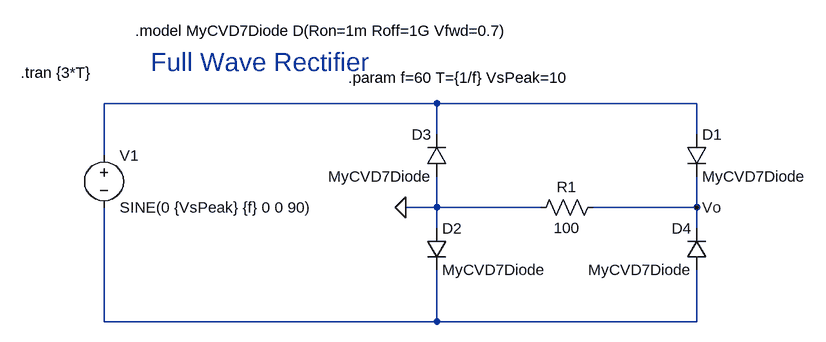
[diagram p0: schematic full_wave_rectifier.asc]
full_wave_rectifier.asc, the LTspice schematic file:
Version 4.1
SHEET 1 1084 680
WIRE 512 48 0 48
WIRE 912 48 512 48
WIRE 512 96 512 48
WIRE 912 96 912 48
WIRE 0 128 0 48
WIRE 512 208 512 160
WIRE 512 208 464 208
WIRE 672 208 512 208
WIRE 912 208 912 160
WIRE 912 208 752 208
WIRE 512 240 512 208
WIRE 912 240 912 208
WIRE 0 384 0 208
WIRE 512 384 512 304
WIRE 512 384 0 384
WIRE 912 384 912 304
WIRE 912 384 512 384
FLAG 464 208 0
FLAG 912 208 Vo
SYMBOL voltage 0 112 R0
WINDOW 123 0 0 Left 0
WINDOW 39 0 0 Left 0
SYMATTR InstName V1
SYMATTR Value SINE(0 {VsPeak} {f} 0 0 90)
SYMBOL diode 896 96 R0
SYMATTR InstName D1
SYMATTR Value MyCVD7Diode
SYMBOL diode 496 240 R0
SYMATTR InstName D2
SYMATTR Value MyCVD7Diode
SYMBOL diode 528 160 R180
WINDOW 0 24 64 Left 2
WINDOW 3 24 0 Left 2
SYMATTR InstName D3
SYMATTR Value MyCVD7Diode
SYMBOL diode 928 304 R180
WINDOW 0 24 64 Left 2
WINDOW 3 24 0 Left 2
SYMATTR InstName D4
SYMATTR Value MyCVD7Diode
SYMBOL res 768 192 R90
WINDOW 0 0 56 VBottom 2
WINDOW 3 32 56 VTop 2
SYMATTR InstName R1
SYMATTR Value 100
TEXT 72 -16 Left 4 ;Full Wave Rectifier
TEXT 48 -64 Left 2 !.model MyCVD7Diode D(Ron=1m Roff=1G Vfwd=0.7)
TEXT -128 0 Left 2 !.tran {3*T}
TEXT 376 8 Left 2 !.param f=60 T={1/f} VsPeak=10

The netlist it stands for:
* full_wave_rectifier.asc
V1 N001 N002 SINE(0 {VsPeak} {f} 0 0 90)
D1 N001 Vo MyCVD7Diode
D2 0 N002 MyCVD7Diode
D3 0 N001 MyCVD7Diode
D4 N002 Vo MyCVD7Diode
R1 Vo 0 100
.model D D
.lib standard.dio
* Full Wave Rectifier
.model MyCVD7Diode D(Ron=1m Roff=1G Vfwd=0.7)
.tran {3*T}
.param f=60 T={1/f} VsPeak=10
.backanno
.end